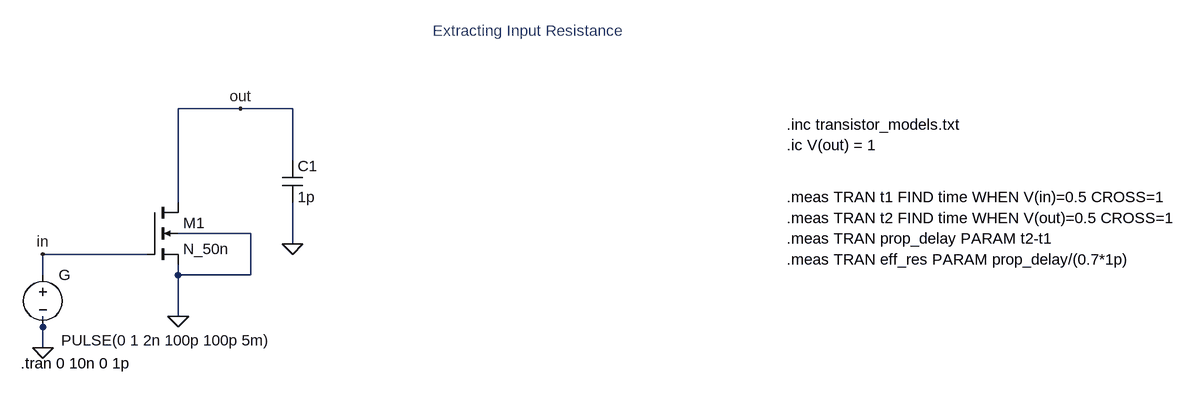
[diagram p0: schematic nmos_R_extract.asc]
nmos_R_extract.asc, the LTspice schematic file:
Version 4
SHEET 1 1424 680
WIRE -48 -96 -144 -96
WIRE 32 -96 -48 -96
WIRE 32 -16 32 -96
WIRE -144 48 -144 -96
WIRE -32 96 -144 96
WIRE 32 112 32 48
WIRE -192 128 -352 128
WIRE -352 160 -352 128
WIRE -144 160 -144 144
WIRE -32 160 -32 96
WIRE -32 160 -144 160
WIRE -144 224 -144 160
WIRE -352 240 -352 224
WIRE -352 272 -352 240
FLAG -144 224 0
FLAG -352 272 0
FLAG 32 112 0
FLAG -48 -96 out
FLAG -352 128 in
SYMBOL nmos4 -192 48 R0
SYMATTR InstName M1
SYMATTR Value N_50n
SYMATTR Value2 l=50n w=500n
SYMBOL voltage -352 144 R0
WINDOW 3 28 117 Left 2
WINDOW 123 0 0 Left 0
WINDOW 39 0 0 Left 0
SYMATTR InstName G
SYMATTR Value PULSE(0 1 2n 100p 100p 5m)
SYMBOL cap 16 -16 R0
SYMATTR InstName C1
SYMATTR Value 1p
TEXT 792 -72 Left 2 !.inc transistor_models.txt
TEXT 248 -216 Left 2 ;Extracting Input Resistance
TEXT 792 -40 Left 2 !.ic V(out) = 1
TEXT -386 296 Left 2 !.tran 0 10n 0 1p
TEXT 792 40 Left 2 !.meas TRAN t1 FIND time WHEN V(in)=0.5 CROSS=1
TEXT 792 72 Left 2 !.meas TRAN t2 FIND time WHEN V(out)=0.5 CROSS=1
TEXT 792 104 Left 2 !.meas TRAN prop_delay PARAM t2-t1
TEXT 792 136 Left 2 !.meas TRAN eff_res PARAM prop_delay/(0.7*1p)

The netlist it stands for:
* nmos_R_extract.asc
M1 out in 0 0 N_50n l=50n w=500n
V§G in 0 PULSE(0 1 2n 100p 100p 5m)
C1 out 0 1p
.model NMOS NMOS
.model PMOS PMOS
.lib standard.mos
.inc transistor_models.txt
* Extracting Input Resistance
.ic V(out) = 1
.tran 0 10n 0 1p
.meas TRAN t1 FIND time WHEN V(in)=0.5 CROSS=1
.meas TRAN t2 FIND time WHEN V(out)=0.5 CROSS=1
.meas TRAN prop_delay PARAM t2-t1
.meas TRAN eff_res PARAM prop_delay/(0.7*1p)
.backanno
.end

* Results of the author's LTspice run, read from the files saved beside the schematic
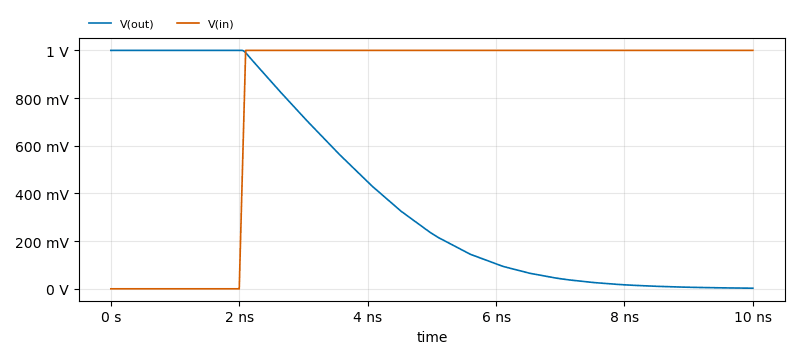
[diagram p1: Transient Analysis of nmos_R_extract.asc, plotted from the saved traces]
* Transient Analysis, 1 run:
*   V(out): min 2.519 mV, max 1 V, average 406 mV, rms 571.3 mV, last 2.519 mV
*   V(in): min 0 V, max 1 V, average 795 mV, rms 890.7 mV, last 1 V
* From the log:
*   t1: time=2.05e-009 at 2.05e-009
*   t2: time=3.79925e-009 at 3.79925e-009
*   prop_delay: t2-t1=1.74925e-009
*   eff_res: prop_delay/(0.7*1p)=2498.93